# Altium project Jinkono Module.PrjPcb (part 2 of 2)

## Sheet Э3-11.SchDoc
size 594 x 420 mm; Address1: Address1; Address2: Address2; Address3: Address3; Address4: Address4; SheetNumber: 10; SheetTotal: 12; DocumentType: Схема электрическая принципиальная
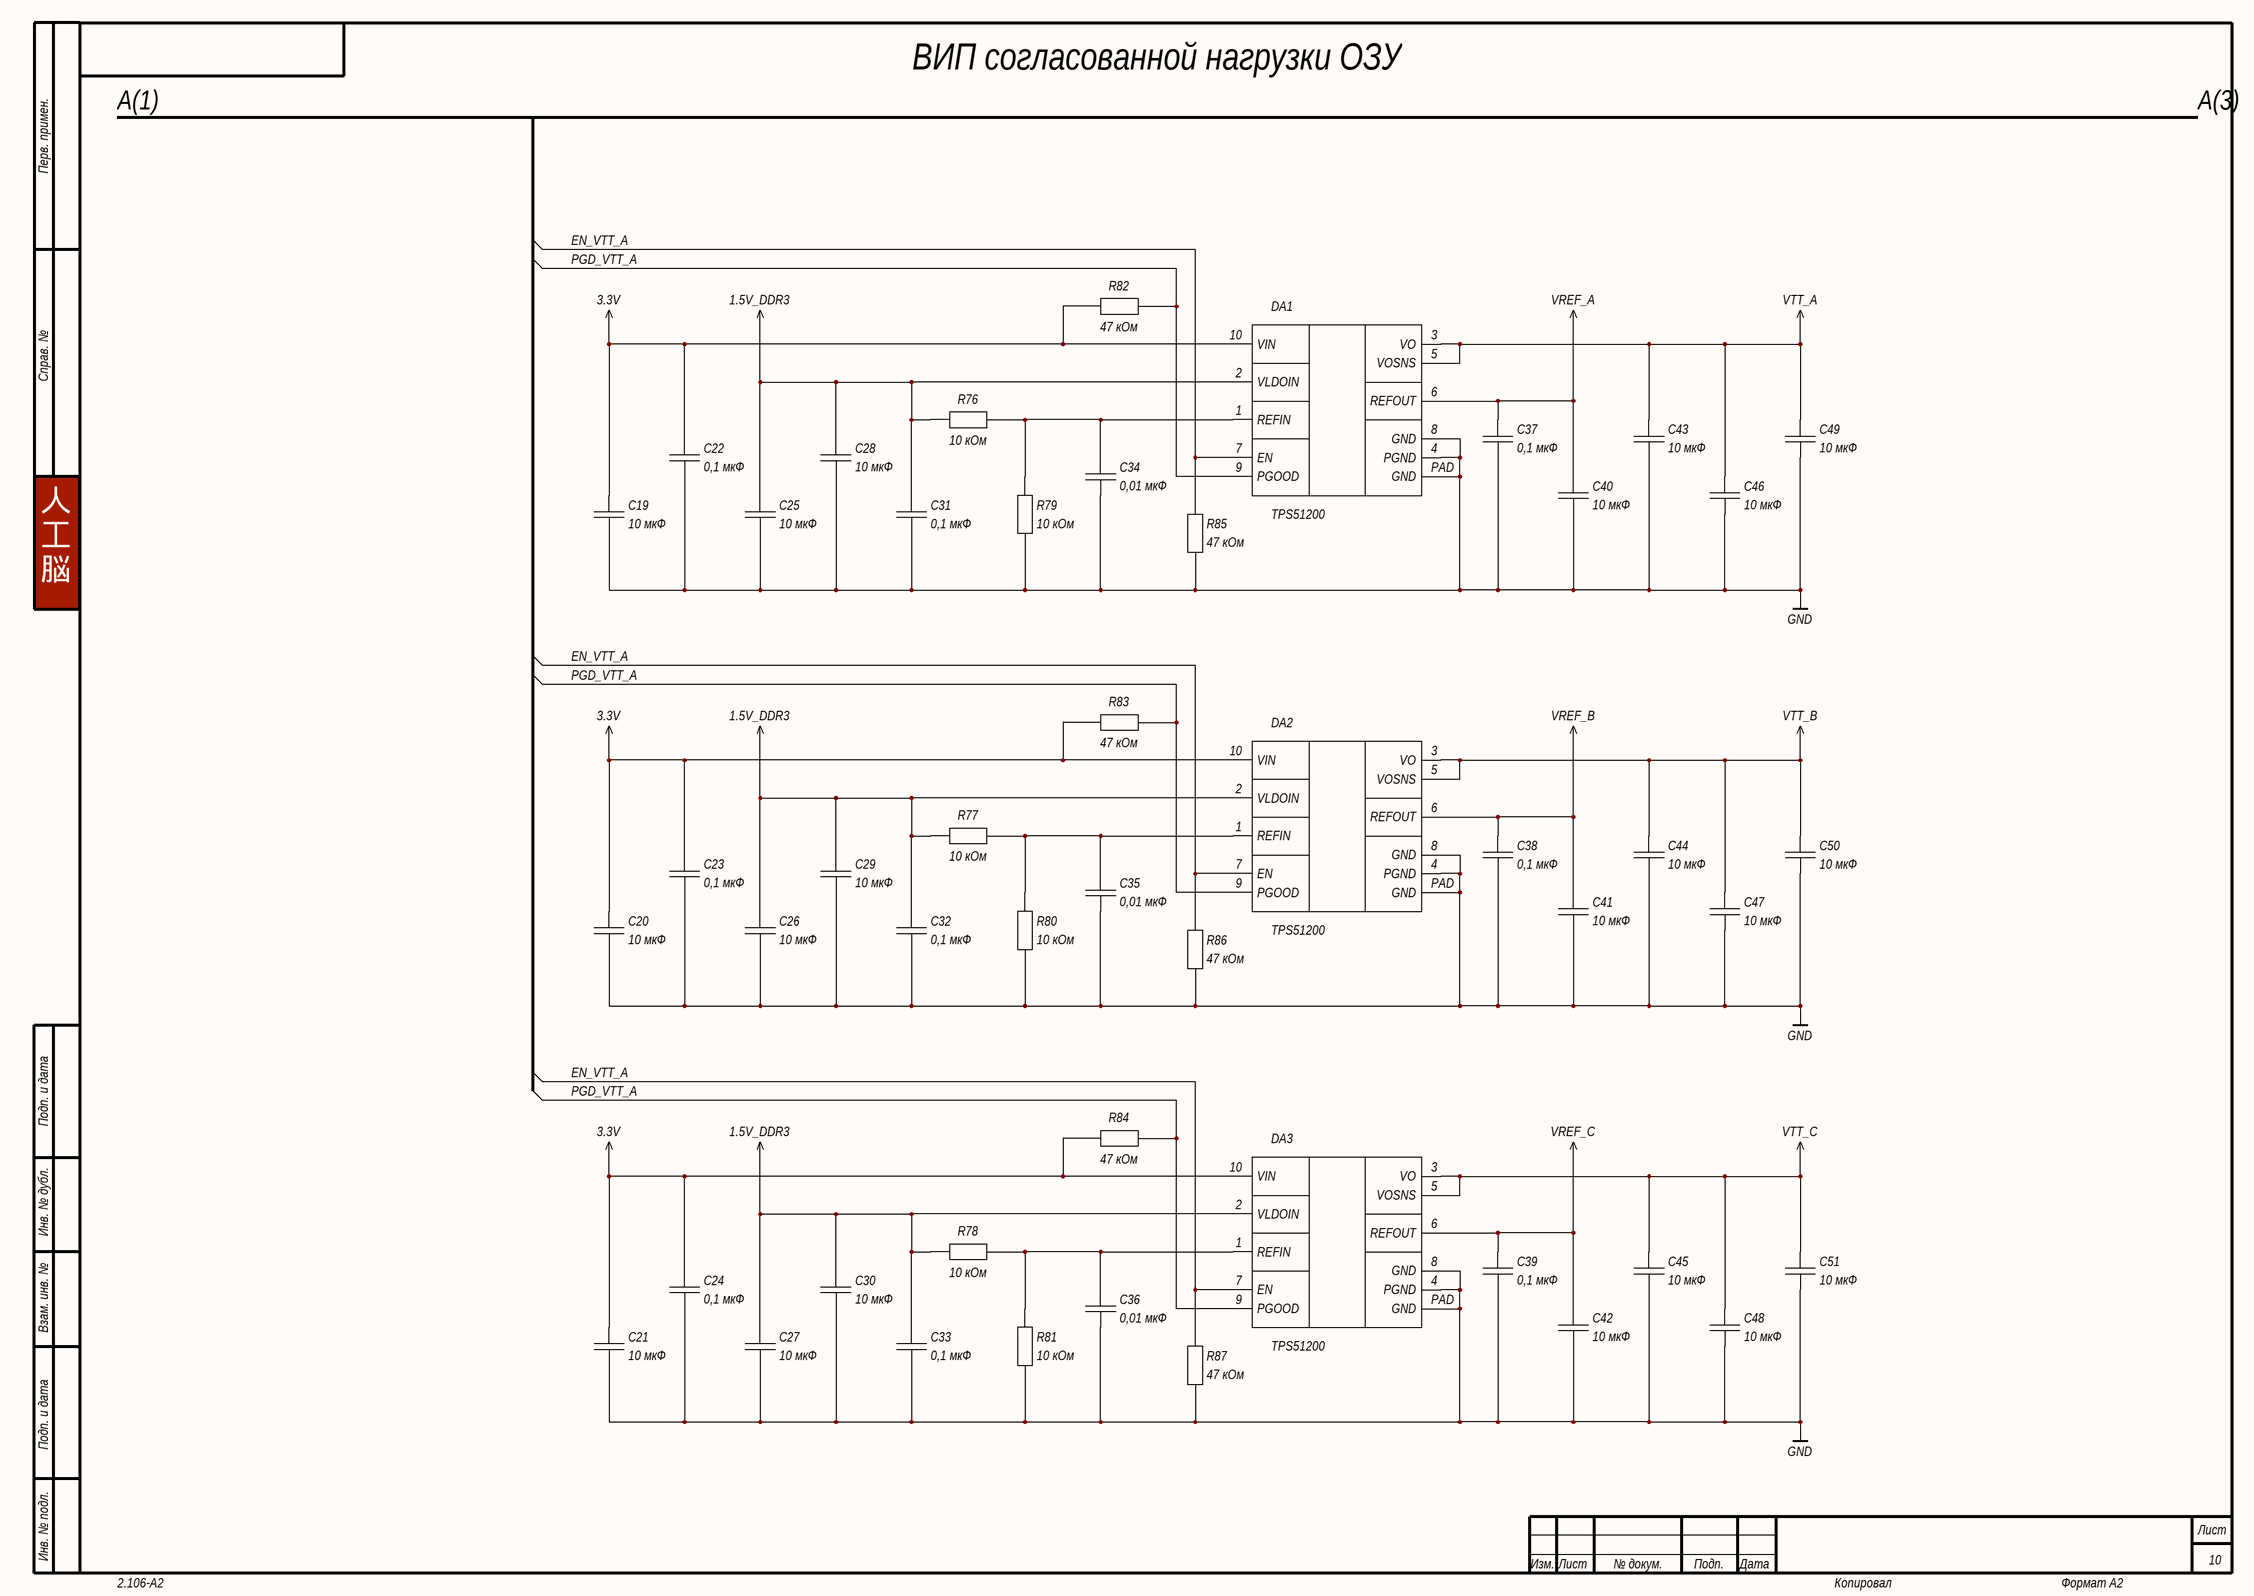
[diagram p9: Э3-11.SchDoc]

### Parts
C19  value 10 мкФ  [C0805-B-1.25mm-NO]  (hidden comment: 1)
C20  value 10 мкФ  [C0805-B-1.25mm-NO]  (hidden comment: 1)
C21  value 10 мкФ  [C0805-B-1.25mm-NO]  (hidden comment: 1)
C22  value 0,1 мкФ  [C0402-B-0.5mm-NO]  (hidden comment: 1)
C23  value 0,1 мкФ  [C0402-B-0.5mm-NO]  (hidden comment: 1)
C24  value 0,1 мкФ  [C0402-B-0.5mm-NO]  (hidden comment: 1)
C25  value 10 мкФ  [C0805-B-1.25mm-NO]  (hidden comment: 1)
C26  value 10 мкФ  [C0805-B-1.25mm-NO]  (hidden comment: 1)
C27  value 10 мкФ  [C0805-B-1.25mm-NO]  (hidden comment: 1)
C28  value 10 мкФ  [C0805-B-1.25mm-NO]  (hidden comment: 1)
C29  value 10 мкФ  [C0805-B-1.25mm-NO]  (hidden comment: 1)
C30  value 10 мкФ  [C0805-B-1.25mm-NO]  (hidden comment: 1)
C31  value 0,1 мкФ  [C0402-B-0.5mm-NO]  (hidden comment: 1)
C32  value 0,1 мкФ  [C0402-B-0.5mm-NO]  (hidden comment: 1)
C33  value 0,1 мкФ  [C0402-B-0.5mm-NO]  (hidden comment: 1)
C34  value 0,01 мкФ  [C0402-B-0.5mm-NO]  (hidden comment: 1)
C35  value 0,01 мкФ  [C0402-B-0.5mm-NO]  (hidden comment: 1)
C36  value 0,01 мкФ  [C0402-B-0.5mm-NO]  (hidden comment: 1)
C37  value 0,1 мкФ  [C0402-B-0.5mm-NO]  (hidden comment: 1)
C38  value 0,1 мкФ  [C0402-B-0.5mm-NO]  (hidden comment: 1)
C39  value 0,1 мкФ  [C0402-B-0.5mm-NO]  (hidden comment: 1)
C40  value 10 мкФ  [C0805-B-1.25mm-NO]  (hidden comment: 1)
C41  value 10 мкФ  [C0805-B-1.25mm-NO]  (hidden comment: 1)
C42  value 10 мкФ  [C0805-B-1.25mm-NO]  (hidden comment: 1)
C43  value 10 мкФ  [C0805-B-1.25mm-NO]  (hidden comment: 1)
C44  value 10 мкФ  [C0805-B-1.25mm-NO]  (hidden comment: 1)
C45  value 10 мкФ  [C0805-B-1.25mm-NO]  (hidden comment: 1)
C46  value 10 мкФ  [C0805-B-1.25mm-NO]  (hidden comment: 1)
C47  value 10 мкФ  [C0805-B-1.25mm-NO]  (hidden comment: 1)
C48  value 10 мкФ  [C0805-B-1.25mm-NO]  (hidden comment: 1)
C49  value 10 мкФ  [C0805-B-1.25mm-NO]  (hidden comment: 1)
C50  value 10 мкФ  [C0805-B-1.25mm-NO]  (hidden comment: 1)
C51  value 10 мкФ  [C0805-B-1.25mm-NO]  (hidden comment: 1)
DA1  1  (value not drawn)
DA2  1  (value not drawn)
DA3  1  (value not drawn)
R76  value 10 кОм  [CR0402-B-0.35mm-NO]  (hidden comment: 1)
R77  value 10 кОм  [CR0402-B-0.35mm-NO]  (hidden comment: 1)
R78  value 10 кОм  [CR0402-B-0.35mm-NO]  (hidden comment: 1)
R79  value 10 кОм  [CR0402-B-0.35mm-NO]  (hidden comment: 1)
R80  value 10 кОм  [CR0402-B-0.35mm-NO]  (hidden comment: 1)
R81  value 10 кОм  [CR0402-B-0.35mm-NO]  (hidden comment: 1)
R82  value 47 кОм  [CR0402-B-0.35mm-NO]  (hidden comment: 1)
R83  value 47 кОм  [CR0402-B-0.35mm-NO]  (hidden comment: 1)
R84  value 47 кОм  [CR0402-B-0.35mm-NO]  (hidden comment: 1)
R85  value 47 кОм  [CR0402-B-0.35mm-NO]  (hidden comment: 1)
R86  value 47 кОм  [CR0402-B-0.35mm-NO]  (hidden comment: 1)
R87  value 47 кОм  [CR0402-B-0.35mm-NO]  (hidden comment: 1)

### Nets
1.5V_DDR3: C25.1 C26.1 C27.1 C28.1 C29.1 C30.1 C31.1 C32.1 C33.1 DA1.2(VLDOIN) DA2.2(VLDOIN) DA3.2(VLDOIN) R76.1 R77.1 R78.1
3.3V: C19.1 C20.1 C21.1 C22.1 C23.1 C24.1 DA1.10(VIN) DA2.10(VIN) DA3.10(VIN) R82.1 R83.1 R84.1
GND: C19.2 C20.2 C21.2 C22.2 C23.2 C24.2 C25.2 C26.2 C27.2 C28.2 C29.2 C30.2 C31.2 C32.2 C33.2 C34.2 C35.2 C36.2 C37.2 C38.2 C39.2 C40.2 C41.2 C42.2 C43.2 C44.2 C45.2 C46.2 C47.2 C48.2 C49.2 C50.2 C51.2 DA1.4(PGND) DA1.8(GND) DA1.PAD(GND) DA2.4(PGND) DA2.8(GND) DA2.PAD(GND) DA3.4(PGND) DA3.8(GND) DA3.PAD(GND) R79.2 R80.2 R81.2 R85.2 R86.2 R87.2
VREF_A: C37.1 C40.1 DA1.6(REFOUT)
VREF_B: C38.1 C41.1 DA2.6(REFOUT)
VREF_C: C39.1 C42.1 DA3.6(REFOUT)
VTT_A: C43.1 C46.1 C49.1 DA1.3(VO) DA1.5(VOSNS)
VTT_B: C44.1 C47.1 C50.1 DA2.3(VO) DA2.5(VOSNS)
VTT_C: C45.1 C48.1 C51.1 DA3.3(VO) DA3.5(VOSNS)
EN_VTT_A: DA1.7(EN) DA2.7(EN) DA3.7(EN) R85.1 R86.1 R87.1
PGD_VTT_A: DA1.9(PGOOD) DA2.9(PGOOD) DA3.9(PGOOD) R82.2 R83.2 R84.2
NetC34_1: C34.1 DA1.1(REFIN) R76.2 R79.1
NetC35_1: C35.1 DA2.1(REFIN) R77.2 R80.1
NetC36_1: C36.1 DA3.1(REFIN) R78.2 R81.1

### Notes on the sheet
- A(1)
- ВИП согласованной нагрузки ОЗУ
- A(3)
- 人
  工
  脳
- Перв. примен.
- Справ. №
- Подп. и дата
- Инв. № дубл.
- Взам. инв. №
- Инв. № подл.
- Изм.
- Лист
- № докум.
- Подп.
- Дата
- 2.106-A2
- Копировал
- Формат А2

### Library data of the parts
C19-C21 C25-C30 C40-C51 = Non Polar Ver.: 0603 10 мкФ ±10% 10 В X5R; TemperatureRange: -...+°C; ComponentType: Конденсатор; Install: 1
C22-C24 C31-C33 C37-C39 = Non Polar Ver.: 0402 0,1 мкФ ±10% 25 В X7R; TemperatureRange: -...+°C; ComponentType: Конденсатор; Install: 1
C34-C36 = Non Polar Ver.: 0402 0,01 мкФ ±10% 25 В X7R; TemperatureRange: -...+°C; ComponentType: Конденсатор; Install: 1
DA1-DA3 = TPS51200: Sink and Source DDR Termination Regulator; Manufacturer: Texas Instruments, Inc.; TemperatureRange: -40...+85°C; ComponentType: Микросхема; Install: 1; PartNumber: TPS51200
R76-R78 = Resistor Hor.: 0402 10 кОм ±1%; TemperatureRange: -...+°C; ComponentType: Резистор; Install: 1
R79-R81 = Resistor Ver.: 0402 10 кОм ±1%; TemperatureRange: -...+°C; ComponentType: Резистор; Install: 1
R82-R84 = Resistor Hor.: 0402 47 кОм ±5%; TemperatureRange: -...+°C; ComponentType: Резистор; Install: 1
R85-R87 = Resistor Ver.: 0402 47 кОм ±5%; TemperatureRange: -...+°C; ComponentType: Резистор; Install: 1

## Sheet Э3-12.SchDoc
size 594 x 420 mm; Address1: Address1; Address2: Address2; Address3: Address3; Address4: Address4; SheetNumber: 12; SheetTotal: 12; DocumentType: Схема электрическая принципиальная
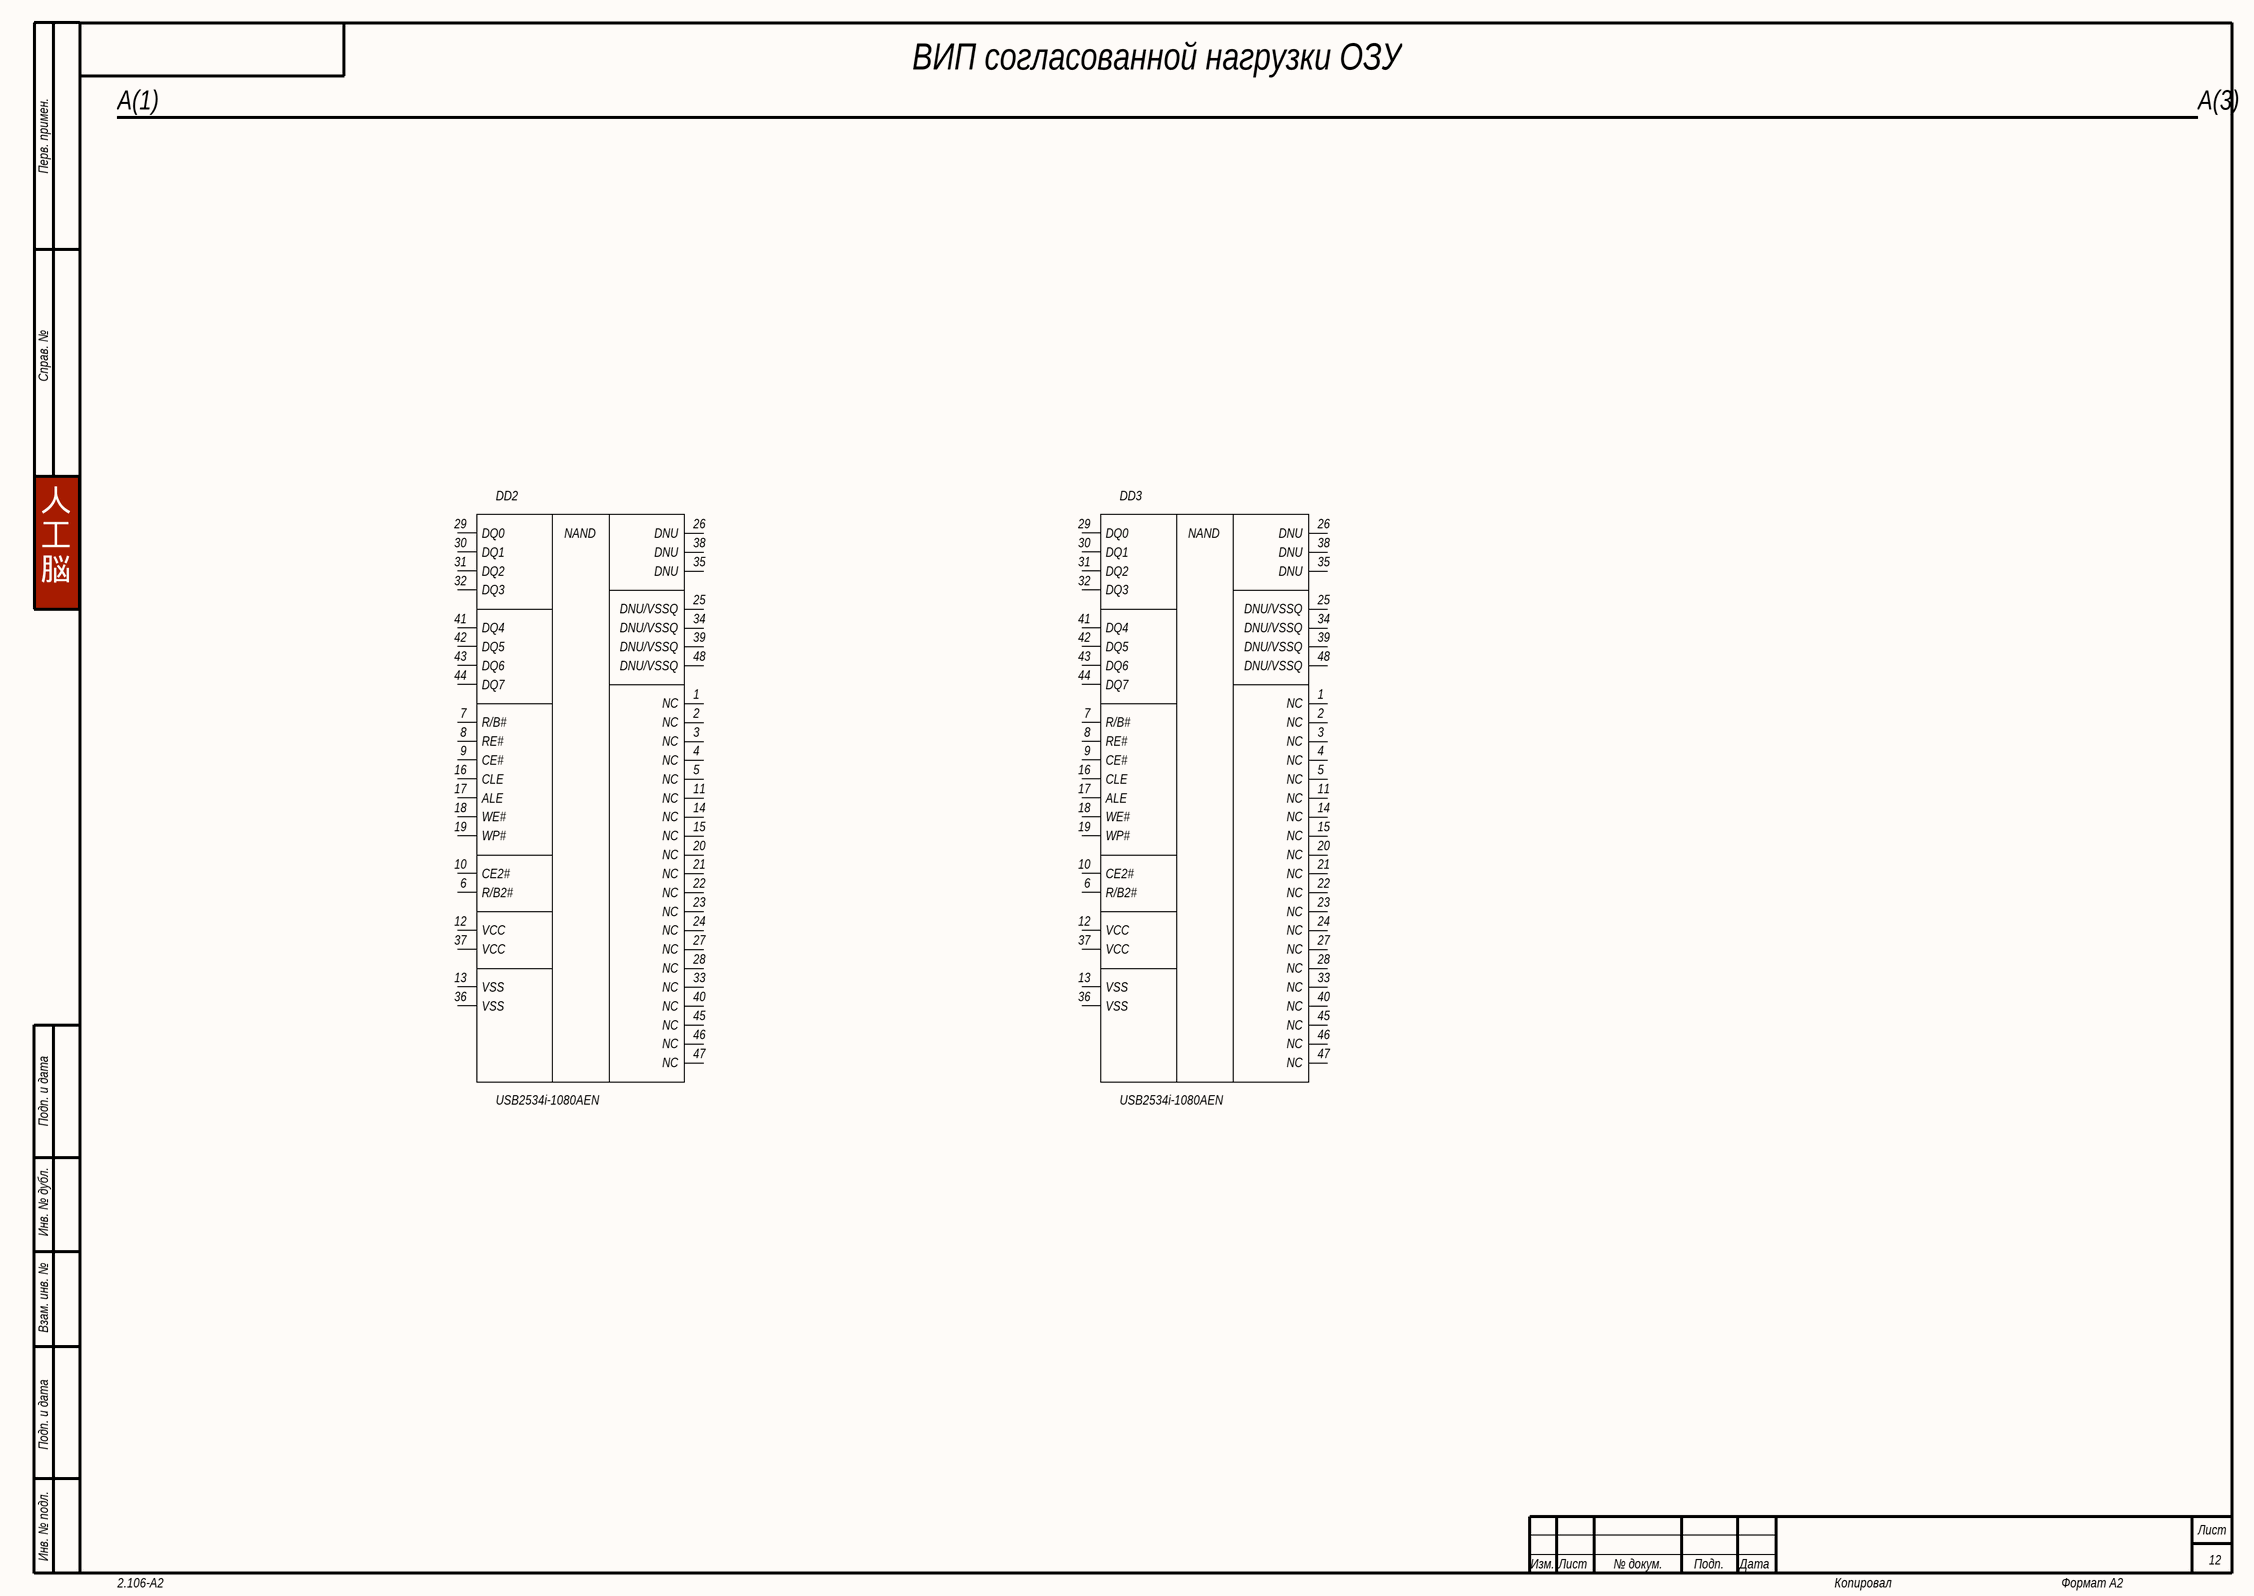
[diagram p10: Э3-12.SchDoc]

### Parts
DD2  USB2534i-1080AEN  [48-TSOP-1]
DD3  USB2534i-1080AEN  [48-TSOP-1]

### Nets

Not connected (* = marked no-connect by the designer): DD2 1(NC) 2(NC) 3(NC) 4(NC) 5(NC) 6(R/B2#) 7(R/B#) 8(RE#) 9(CE#) 10(CE2#) 11(NC) 12(VCC) 13(VSS) 14(NC) 15(NC) 16(CLE) 17(ALE) 18(WE#) 19(WP#) 20(NC) 21(NC) 22(NC) 23(NC) 24(NC) 25(DNU/VSSQ) 26(DNU) 27(NC) 28(NC) 29(DQ0) 30(DQ1) 31(DQ2) 32(DQ3) 33(NC) 34(DNU/VSSQ) 35(DNU) 36(VSS) 37(VCC) 38(DNU) 39(DNU/VSSQ) 40(NC) 41(DQ4) 42(DQ5) 43(DQ6) 44(DQ7) 45(NC) 46(NC) 47(NC) 48(DNU/VSSQ); DD3 1(NC) 2(NC) 3(NC) 4(NC) 5(NC) 6(R/B2#) 7(R/B#) 8(RE#) 9(CE#) 10(CE2#) 11(NC) 12(VCC) 13(VSS) 14(NC) 15(NC) 16(CLE) 17(ALE) 18(WE#) 19(WP#) 20(NC) 21(NC) 22(NC) 23(NC) 24(NC) 25(DNU/VSSQ) 26(DNU) 27(NC) 28(NC) 29(DQ0) 30(DQ1) 31(DQ2) 32(DQ3) 33(NC) 34(DNU/VSSQ) 35(DNU) 36(VSS) 37(VCC) 38(DNU) 39(DNU/VSSQ) 40(NC) 41(DQ4) 42(DQ5) 43(DQ6) 44(DQ7) 45(NC) 46(NC) 47(NC) 48(DNU/VSSQ)

### Notes on the sheet
- A(1)
- ВИП согласованной нагрузки ОЗУ
- A(3)
- 人
  工
  脳
- Перв. примен.
- Справ. №
- Подп. и дата
- Инв. № дубл.
- Взам. инв. №
- Инв. № подл.
- Изм.
- Лист
- № докум.
- Подп.
- Дата
- 2.106-A2
- Копировал
- Формат А2
- (in symbol MT29F32G08ABAAAWP-ITZ:A) NAND

### Library data of the parts
DD2 DD3 = MT29F32G08ABAAAWP-ITZ:A: SLC NAND Flash 32 Гб; Manufacturer: Micron Technology, Inc.; TemperatureRange: -40...+85°C; Package: 48-TSOP; DatasheetURL: *; HelpURL: *; PinCount: 48; PartNumber: USB2534i-1080AEN; ComponentType: IC

## Nets that join several sheets
1.5V_DDR3: Э3-7 (72 pins), Э3-8 (72 pins), Э3-9 (72 pins), Э3-11 (15 pins)
GND: Э3-6 (174 pins), Э3-7 (84 pins), Э3-8 (84 pins), Э3-9 (84 pins), Э3-10 (18 pins), Э3-11 (48 pins)
VREF_A: Э3-7 (8 pins), Э3-11 (C37.1 C40.1 DA1.6)
VREF_B: Э3-8 (8 pins), Э3-11 (C38.1 C41.1 DA2.6)
VREF_C: Э3-9 (8 pins), Э3-11 (C39.1 C42.1 DA3.6)
VTT_A: Э3-10 (30 pins), Э3-11 (5 pins)
VTT_B: Э3-10 (30 pins), Э3-11 (5 pins)
VTT_C: Э3-10 (30 pins), Э3-11 (5 pins)
DDR3_A0_ZQ: Э3-7 (DS1.L8), Э3-8 (DS5.L8), Э3-9 (DS9.L8)
DDR3_A1_ZQ: Э3-7 (DS2.L8), Э3-8 (DS6.L8), Э3-9 (DS10.L8)
DDR3_A2_ZQ: Э3-7 (DS3.L8), Э3-8 (DS7.L8), Э3-9 (DS11.L8)
DDR3_A3_ZQ: Э3-7 (DS4.L8), Э3-8 (DS8.L8), Э3-9 (DS12.L8)
DDR3_A_A0: Э3-7 (DS1.N3 DS2.N3 DS3.N3 DS4.N3), Э3-10 (R1.1)
DDR3_A_A1: Э3-7 (DS1.P7 DS2.P7 DS3.P7 DS4.P7), Э3-10 (R14.1)
DDR3_A_A2: Э3-7 (DS1.P3 DS2.P3 DS3.P3 DS4.P3), Э3-10 (R2.1)
DDR3_A_A3: Э3-7 (DS1.N2 DS2.N2 DS3.N2 DS4.N2), Э3-10 (R15.1)
DDR3_A_A4: Э3-7 (DS1.P8 DS2.P8 DS3.P8 DS4.P8), Э3-10 (R3.1)
DDR3_A_A5: Э3-7 (DS1.P2 DS2.P2 DS3.P2 DS4.P2), Э3-10 (R16.1)
DDR3_A_A6: Э3-7 (DS1.R8 DS2.R8 DS3.R8 DS4.R8), Э3-10 (R4.1)
DDR3_A_A7: Э3-7 (DS1.R2 DS2.R2 DS3.R2 DS4.R2), Э3-10 (R17.1)
DDR3_A_A8: Э3-7 (DS1.T8 DS2.T8 DS3.T8 DS4.T8), Э3-10 (R5.1)
DDR3_A_A9: Э3-7 (DS1.R3 DS2.R3 DS3.R3 DS4.R3), Э3-10 (R18.1)
DDR3_A_A10: Э3-7 (DS1.L7 DS2.L7 DS3.L7 DS4.L7), Э3-10 (R6.1)
DDR3_A_A11: Э3-7 (DS1.R7 DS2.R7 DS3.R7 DS4.R7), Э3-10 (R19.1)
DDR3_A_A12: Э3-7 (DS1.N7 DS2.N7 DS3.N7 DS4.N7), Э3-10 (R7.1)
DDR3_A_A13: Э3-7 (DS1.T3 DS2.T3 DS3.T3 DS4.T3), Э3-10 (R20.1)
DDR3_A_A14: Э3-7 (DS1.T7 DS2.T7 DS3.T7 DS4.T7), Э3-10 (R8.1)
DDR3_A_BA0: Э3-7 (DS1.M2 DS2.M2 DS3.M2 DS4.M2), Э3-10 (R21.1)
DDR3_A_BA1: Э3-7 (DS1.N8 DS2.N8 DS3.N8 DS4.N8), Э3-10 (R9.1)
DDR3_A_BA2: Э3-7 (DS1.M3 DS2.M3 DS3.M3 DS4.M3), Э3-10 (R22.1)
DDR3_A_CK_N: Э3-7 (DS1.K7 DS2.K7 DS3.K7 DS4.K7), Э3-10 (R13.2)
DDR3_A_CK_P: Э3-7 (DS1.J7 DS2.J7 DS3.J7 DS4.J7), Э3-10 (R13.1)
DDR3_A_CKE: Э3-7 (DS1.K9 DS2.K9 DS3.K9 DS4.K9), Э3-10 (R10.1)
DDR3_A_nCAS: Э3-7 (DS1.K3 DS2.K3 DS3.K3 DS4.K3), Э3-10 (R24.1)
DDR3_A_nCS: Э3-7 (DS1.L2 DS2.L2 DS3.L2 DS4.L2), Э3-10 (R23.1)
DDR3_A_nRAS: Э3-7 (DS1.J3 DS2.J3 DS3.J3 DS4.J3), Э3-10 (R11.1)
DDR3_A_nWE: Э3-7 (DS1.L3 DS2.L3 DS3.L3 DS4.L3), Э3-10 (R12.1)
DDR3_A_ODT: Э3-7 (DS1.K1 DS2.K1 DS3.K1 DS4.K1), Э3-10 (R25.1)
DDR3_B_A0: Э3-8 (DS5.N3 DS6.N3 DS7.N3 DS8.N3), Э3-10 (R26.1)
DDR3_B_A1: Э3-8 (DS5.P7 DS6.P7 DS7.P7 DS8.P7), Э3-10 (R39.1)
DDR3_B_A2: Э3-8 (DS5.P3 DS6.P3 DS7.P3 DS8.P3), Э3-10 (R27.1)
DDR3_B_A3: Э3-8 (DS5.N2 DS6.N2 DS7.N2 DS8.N2), Э3-10 (R40.1)
DDR3_B_A4: Э3-8 (DS5.P8 DS6.P8 DS7.P8 DS8.P8), Э3-10 (R28.1)
DDR3_B_A5: Э3-8 (DS5.P2 DS6.P2 DS7.P2 DS8.P2), Э3-10 (R41.1)
DDR3_B_A6: Э3-8 (DS5.R8 DS6.R8 DS7.R8 DS8.R8), Э3-10 (R29.1)
DDR3_B_A7: Э3-8 (DS5.R2 DS6.R2 DS7.R2 DS8.R2), Э3-10 (R42.1)
DDR3_B_A8: Э3-8 (DS5.T8 DS6.T8 DS7.T8 DS8.T8), Э3-10 (R30.1)
DDR3_B_A9: Э3-8 (DS5.R3 DS6.R3 DS7.R3 DS8.R3), Э3-10 (R43.1)
DDR3_B_A10: Э3-8 (DS5.L7 DS6.L7 DS7.L7 DS8.L7), Э3-10 (R31.1)
DDR3_B_A11: Э3-8 (DS5.R7 DS6.R7 DS7.R7 DS8.R7), Э3-10 (R44.1)
DDR3_B_A12: Э3-8 (DS5.N7 DS6.N7 DS7.N7 DS8.N7), Э3-10 (R32.1)
DDR3_B_A13: Э3-8 (DS5.T3 DS6.T3 DS7.T3 DS8.T3), Э3-10 (R45.1)
DDR3_B_A14: Э3-8 (DS5.T7 DS6.T7 DS7.T7 DS8.T7), Э3-10 (R33.1)
DDR3_B_BA0: Э3-8 (DS5.M2 DS6.M2 DS7.M2 DS8.M2), Э3-10 (R46.1)
DDR3_B_BA1: Э3-8 (DS5.N8 DS6.N8 DS7.N8 DS8.N8), Э3-10 (R34.1)
DDR3_B_BA2: Э3-8 (DS5.M3 DS6.M3 DS7.M3 DS8.M3), Э3-10 (R47.1)
DDR3_B_CK_N: Э3-8 (DS5.K7 DS6.K7 DS7.K7 DS8.K7), Э3-10 (R38.2)
DDR3_B_CK_P: Э3-8 (DS5.J7 DS6.J7 DS7.J7 DS8.J7), Э3-10 (R38.1)
DDR3_B_CKE: Э3-8 (DS5.K9 DS6.K9 DS7.K9 DS8.K9), Э3-10 (R35.1)
DDR3_B_nCAS: Э3-8 (DS5.K3 DS6.K3 DS7.K3 DS8.K3), Э3-10 (R49.1)
DDR3_B_nCS: Э3-8 (DS5.L2 DS6.L2 DS7.L2 DS8.L2), Э3-10 (R48.1)
DDR3_B_nRAS: Э3-8 (DS5.J3 DS6.J3 DS7.J3 DS8.J3), Э3-10 (R36.1)
DDR3_B_nWE: Э3-8 (DS5.L3 DS6.L3 DS7.L3 DS8.L3), Э3-10 (R37.1)
DDR3_B_ODT: Э3-8 (DS5.K1 DS6.K1 DS7.K1 DS8.K1), Э3-10 (R50.1)
DDR3_C_A0: Э3-9 (DS9.N3 DS10.N3 DS11.N3 DS12.N3), Э3-10 (R51.1)
DDR3_C_A1: Э3-9 (DS9.P7 DS10.P7 DS11.P7 DS12.P7), Э3-10 (R64.1)
DDR3_C_A2: Э3-9 (DS9.P3 DS10.P3 DS11.P3 DS12.P3), Э3-10 (R52.1)
DDR3_C_A3: Э3-9 (DS9.N2 DS10.N2 DS11.N2 DS12.N2), Э3-10 (R65.1)
DDR3_C_A4: Э3-9 (DS9.P8 DS10.P8 DS11.P8 DS12.P8), Э3-10 (R53.1)
DDR3_C_A5: Э3-9 (DS9.P2 DS10.P2 DS11.P2 DS12.P2), Э3-10 (R66.1)
DDR3_C_A6: Э3-9 (DS9.R8 DS10.R8 DS11.R8 DS12.R8), Э3-10 (R54.1)
DDR3_C_A7: Э3-9 (DS9.R2 DS10.R2 DS11.R2 DS12.R2), Э3-10 (R67.1)
DDR3_C_A8: Э3-9 (DS9.T8 DS10.T8 DS11.T8 DS12.T8), Э3-10 (R55.1)
DDR3_C_A9: Э3-9 (DS9.R3 DS10.R3 DS11.R3 DS12.R3), Э3-10 (R68.1)
DDR3_C_A10: Э3-9 (DS9.L7 DS10.L7 DS11.L7 DS12.L7), Э3-10 (R56.1)
DDR3_C_A11: Э3-9 (DS9.R7 DS10.R7 DS11.R7 DS12.R7), Э3-10 (R69.1)
DDR3_C_A12: Э3-9 (DS9.N7 DS10.N7 DS11.N7 DS12.N7), Э3-10 (R57.1)
DDR3_C_A13: Э3-9 (DS9.T3 DS10.T3 DS11.T3 DS12.T3), Э3-10 (R70.1)
DDR3_C_A14: Э3-9 (DS9.T7 DS10.T7 DS11.T7 DS12.T7), Э3-10 (R58.1)
DDR3_C_BA0: Э3-9 (DS9.M2 DS10.M2 DS11.M2 DS12.M2), Э3-10 (R71.1)
DDR3_C_BA1: Э3-9 (DS9.N8 DS10.N8 DS11.N8 DS12.N8), Э3-10 (R59.1)
DDR3_C_BA2: Э3-9 (DS9.M3 DS10.M3 DS11.M3 DS12.M3), Э3-10 (R72.1)
DDR3_C_CK_N: Э3-9 (DS9.K7 DS10.K7 DS11.K7 DS12.K7), Э3-10 (R63.2)
DDR3_C_CK_P: Э3-9 (DS9.J7 DS10.J7 DS11.J7 DS12.J7), Э3-10 (R63.1)
DDR3_C_CKE: Э3-9 (DS9.K9 DS10.K9 DS11.K9 DS12.K9), Э3-10 (R60.1)
DDR3_C_nCAS: Э3-9 (DS9.K3 DS10.K3 DS11.K3 DS12.K3), Э3-10 (R74.1)
DDR3_C_nCS: Э3-9 (DS9.L2 DS10.L2 DS11.L2 DS12.L2), Э3-10 (R73.1)
DDR3_C_nRAS: Э3-9 (DS9.J3 DS10.J3 DS11.J3 DS12.J3), Э3-10 (R61.1)
DDR3_C_nWE: Э3-9 (DS9.L3 DS10.L3 DS11.L3 DS12.L3), Э3-10 (R62.1)
DDR3_C_ODT: Э3-9 (DS9.K1 DS10.K1 DS11.K1 DS12.K1), Э3-10 (R75.1)